# EAGLE design heart (EAGLE 7.6.0)
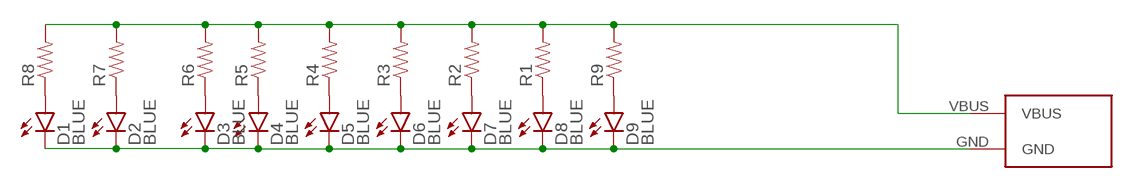
[diagram p0: schematic, sheet 1]

## Parts
D1  BLUE  LED-BLUE0603  [LED-0603]
D2  BLUE  LED-BLUE0603  [LED-0603]
D3  BLUE  LED-BLUE0603  [LED-0603]
D4  BLUE  LED-BLUE0603  [LED-0603]
D5  BLUE  LED-BLUE0603  [LED-0603]
D6  BLUE  LED-BLUE0603  [LED-0603]
D7  BLUE  LED-BLUE0603  [LED-0603]
D8  BLUE  LED-BLUE0603  [LED-0603]
D9  BLUE  LED-BLUE0603  [LED-0603]
R1  RESISTOR0603-RES  [0603-RES]
R2  RESISTOR0603-RES  [0603-RES]
R3  RESISTOR0603-RES  [0603-RES]
R4  RESISTOR0603-RES  [0603-RES]
R5  RESISTOR0603-RES  [0603-RES]
R6  RESISTOR0603-RES  [0603-RES]
R7  RESISTOR0603-RES  [0603-RES]
R8  RESISTOR0603-RES  [0603-RES]
R9  RESISTOR0603-RES  [0603-RES]
U$1  USBMALEA  [USBMALEA]

## Nets
5V: R1.2 R2.2 R3.2 R4.2 R5.2 R6.2 R7.2 R8.2 R9.2 U$1.VBUS
GND: D1.C D2.C D3.C D4.C D5.C D6.C D7.C D8.C D9.C U$1.GND
N$1: D8.A R1.1
N$2: D7.A R2.1
N$3: D6.A R3.1
N$4: D5.A R4.1
N$5: D4.A R5.1
N$6: D3.A R6.1
N$7: D2.A R7.1
N$8: D1.A R8.1
N$10: D9.A R9.1

## Library data of the parts
D1-D9 = SparkFun-LED:LED-BLUE: Blue LEDs for production use Various blue LEDs stocked by SparkFun production 0603 - DIO-08575 Rebel - DIO-09553 1206 - DIO-09911; PROD_ID: DIO-08575
R1-R9 = SparkFun-Resistors:RESISTOR: Resistor Basic schematic elements and footprints for 0603, 1206, and PTH resistors.
U$1 = usbmalea_connectorless:USBMALEA

## Board
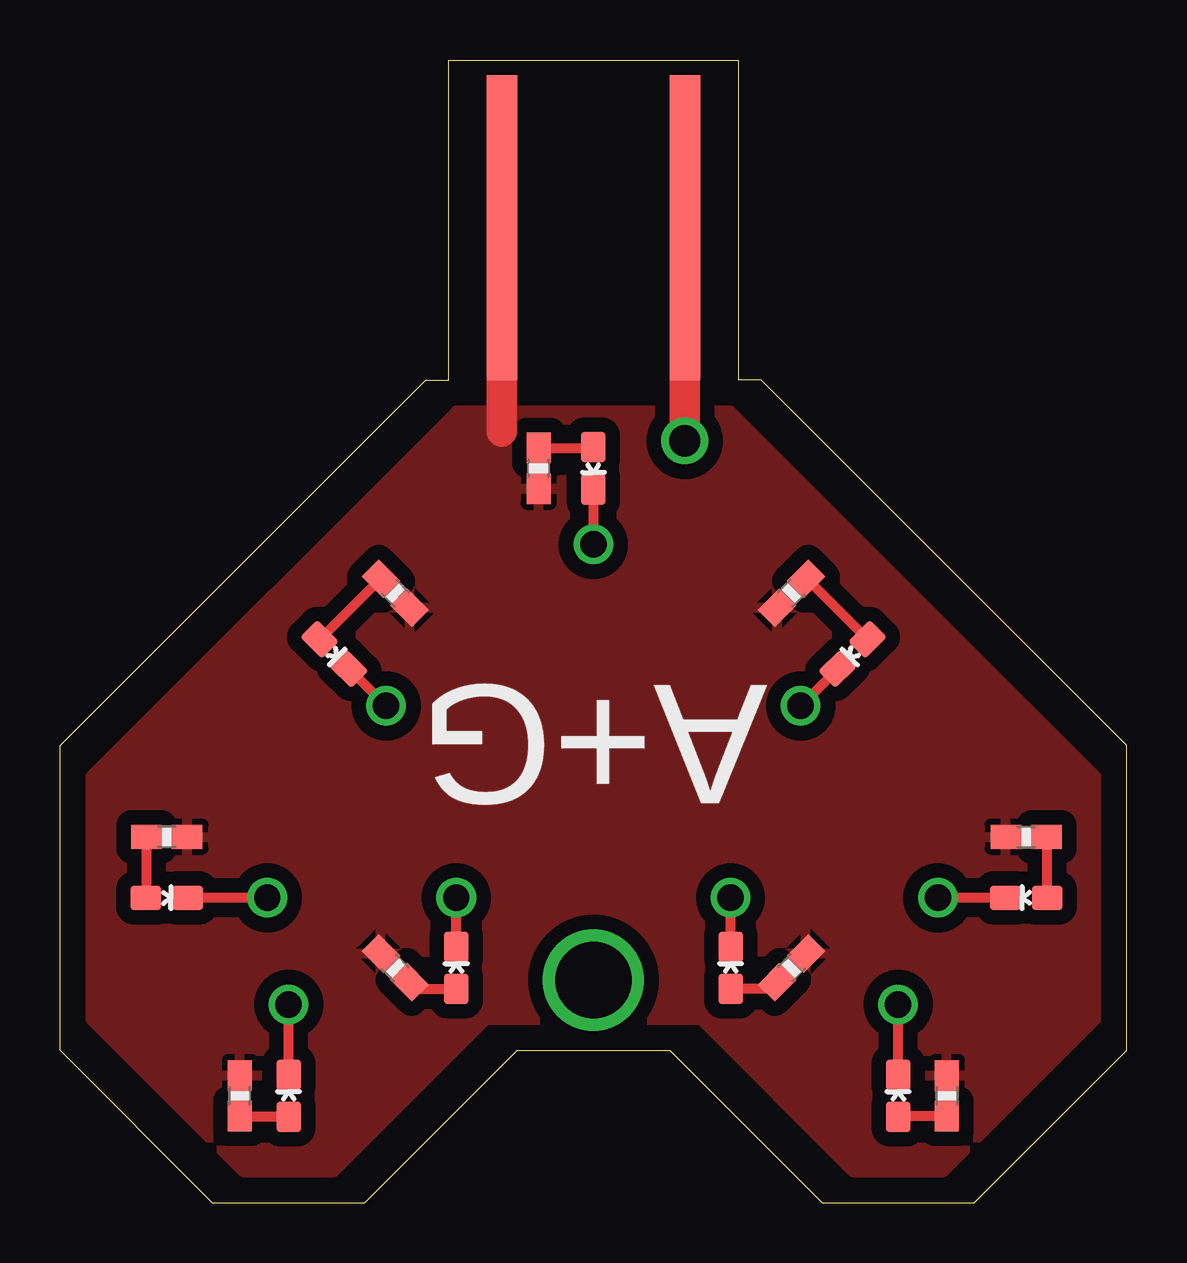
[diagram p1: board, top side]
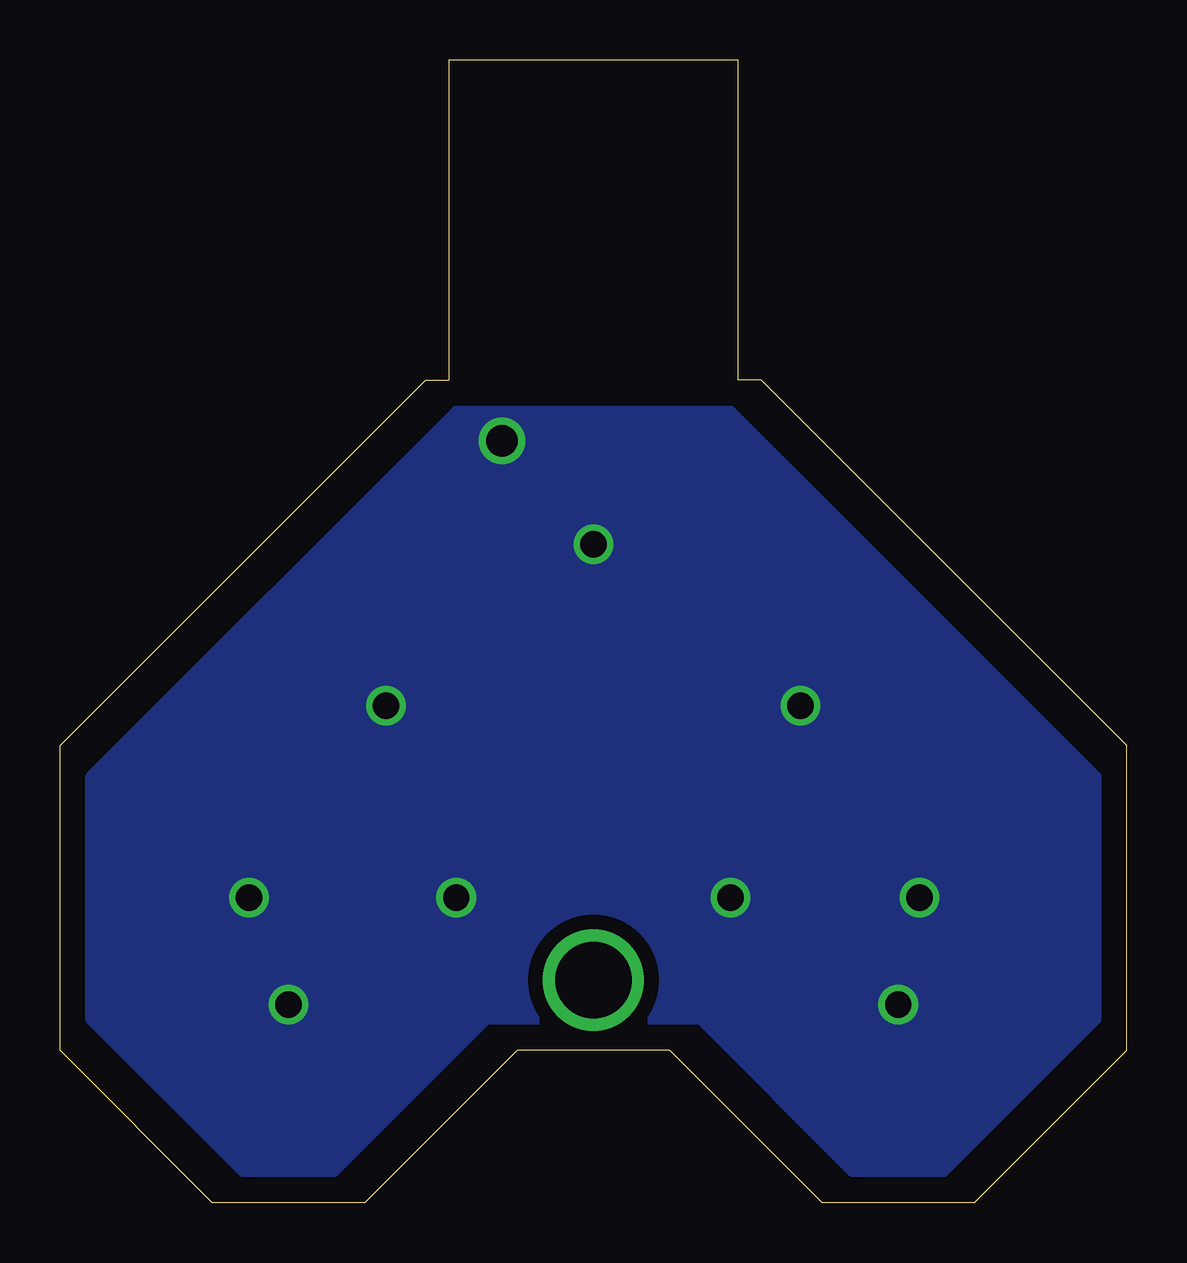
[diagram p2: board, bottom side, seen from below]

Size 44.45 x 47.62 mm. Coordinates in mm from the lower left corner, seen from the top.
Outline: 16.19,34.29 15.24,34.29 0,19.05 0,6.35 6.35,0 12.7,0 19.05,6.35 25.4,6.35 31.75,0 38.1,0 44.45,6.35 44.45,19.05 29.21,34.29 28.26,34.29
Copper layers (1*16): Top 0.035mm / dielectric 1.5mm / Bottom 0.035mm
Design rules "SeeedStudio_2layer_DRU_no_angle_20140221": minimum track width 6mil, minimum drill 12mil, track to track 6mil, track to pad 6mil, pad to pad 6mil, via to via 6mil, smd to smd 0mil, copper to edge 10mil, drill to drill 10mil, minimum pad ring 10mil, minimum via ring 6mil, stop-mask expansion 2mil, vias tented up to drill 100mil, thermal gap 10mil

### Footprints (pad centres in the part's own frame; a part is rotated, then mirrored left to right if it is on the bottom)
LED-0603 = smd 1.016 x 1.27: A 0,-0.877; C 0,0.877
0603-RES = smd 1.27 x 1: 1 -0.85,0; 2 0.85,0
USBMALEA = smd 1.27 x 12.7: GND 3.81,0; VBUS -3.81,0

### Placement (x,y rotation side)
D1  4.45,12.7 270 top
D2  40.26,12.7 90 top
D3  34.92,4.45 0 top
D4  9.53,4.45 0 top
D5  11.43,22.86 225 top
D6  33.02,22.86 135 top
D7  22.23,30.61 180 top
D8  16.51,9.78 0 top
D9  27.94,9.78 0 top
R1  13.97,9.78 135 top
R2  19.94,30.61 270 top
R3  30.48,25.4 225 top
R4  13.97,25.4 315 top
R5  7.49,4.45 90 top
R6  36.96,4.45 90 top
R7  40.26,15.24 180 top
R8  4.45,15.24 0 top
R9  30.48,9.78 45 top
U$1  22.23,40.64 0 top

### Tracks (layer width: path | path; a pad name or v marks a point on that pad's centre or on a via)
5V
  Top 1.016: U$1.VBUS
  Top 1.27: U$1.VBUS 18.41,32.13
  pour Top (isolate 0.61, rank 6): 16.51,33.02 1.27,17.78 1.27,7.62 7.62,1.27 11.43,1.27 17.78,7.62 26.67,7.62 33.02,1.27 36.83,1.27 43.18,7.62 43.18,17.78 27.94,33.02
GND  (via drill 1.1, 1.3)
  Top 0.406: D3.C v34.92,8.26 | D2.C v36.58,12.7 | D9.C v27.94,12.7 | D8.C v16.51,12.7 | D4.C v9.53,8.26 | v8.64,12.7 D1.C | v13.59,20.7 D5.C | D7.C v22.23,27.43 | D6.C v30.86,20.7
  Top 0.61: v13.59,20.7
  Top 1.27: U$1.GND v26.04,31.75
  pour Bottom (isolate 0.61, rank 6): 16.51,33.02 1.27,17.78 1.27,7.62 7.62,1.27 11.43,1.27 17.78,7.62 26.67,7.62 33.02,1.27 36.83,1.27 43.18,7.62 43.18,17.78 27.94,33.02
N$1
  Top 0.406: R1.1 14.85,8.9 D8.A
N$2
  Top 0.406: R2.1 22.2,31.46
  Top 0.61: 22.2,31.46 D7.A
N$3
  Top 0.406: 31.12,26 D6.A
  Top 0.61: R3.1 31.12,26
N$4
  Top 0.406: 10.85,23.48 R4.1
  Top 0.61: D5.A 10.85,23.48
N$5
  Top 0.406: D4.A 7.52,3.57
  Top 0.61: 7.52,3.57 R5.1
N$6
  Top 0.406: R6.1 34.95,3.6 D3.A
N$7
  Top 0.406: R7.1 41.11,12.73
  Top 0.61: 41.11,12.73 D2.A
N$8
  Top 0.406: R8.1 3.6,12.73
  Top 0.61: 3.6,12.73 D1.A
N$9  (via drill 3.2)
  other vias: 22.23,9.27
N$10
  Top 0.406: R9.1 29.6,8.9 D9.A

### Text on the board
tNames: A+G